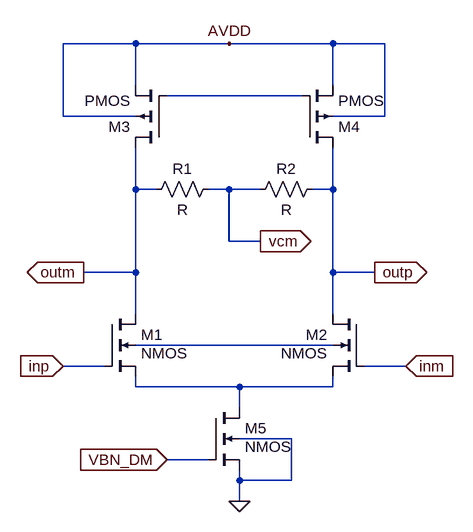
[diagram p0: schematic zc_dm_amp.asc]
zc_dm_amp.asc, the LTspice schematic file:
Version 4
SHEET 1 1464 708
WIRE 336 -176 224 -176
WIRE 480 -176 336 -176
WIRE 640 -176 480 -176
WIRE 720 -176 640 -176
WIRE 336 -112 336 -176
WIRE 640 -112 640 -176
WIRE 592 -96 384 -96
WIRE 224 -64 224 -176
WIRE 336 -64 224 -64
WIRE 720 -64 720 -176
WIRE 720 -64 640 -64
WIRE 336 48 336 -16
WIRE 368 48 336 48
WIRE 480 48 448 48
WIRE 528 48 480 48
WIRE 640 48 640 -16
WIRE 640 48 608 48
WIRE 480 128 480 48
WIRE 528 128 480 128
WIRE 336 176 336 48
WIRE 336 176 256 176
WIRE 640 176 640 48
WIRE 704 176 640 176
WIRE 336 240 336 176
WIRE 640 240 640 176
WIRE 640 288 336 288
WIRE 288 320 224 320
WIRE 752 320 688 320
WIRE 336 352 336 336
WIRE 496 352 336 352
WIRE 640 352 640 336
WIRE 640 352 496 352
WIRE 496 384 496 352
WIRE 576 432 496 432
WIRE 448 464 384 464
WIRE 496 496 496 480
WIRE 576 496 576 432
WIRE 576 496 496 496
WIRE 496 528 496 496
FLAG 496 528 0
FLAG 224 320 inp
IOPIN 224 320 In
FLAG 384 464 VBN_DM
IOPIN 384 464 In
FLAG 704 176 outp
IOPIN 704 176 Out
FLAG 256 176 outm
IOPIN 256 176 Out
FLAG 752 320 inm
IOPIN 752 320 In
FLAG 480 -176 AVDD
FLAG 528 128 vcm
IOPIN 528 128 Out
SYMBOL nmos4 288 240 R0
WINDOW 3 56 60 Left 2
SYMATTR InstName M1
SYMBOL pmos4 384 -16 R180
SYMATTR InstName M3
SYMBOL nmos4 688 240 M0
WINDOW 3 56 60 Left 2
SYMATTR InstName M2
SYMBOL pmos4 592 -16 M180
SYMATTR InstName M4
SYMBOL nmos4 448 384 R0
WINDOW 3 56 60 Left 2
SYMATTR InstName M5
SYMBOL res 464 32 R90
WINDOW 0 0 56 VBottom 2
WINDOW 3 32 56 VTop 2
SYMATTR InstName R1
SYMBOL res 624 32 R90
WINDOW 0 0 56 VBottom 2
WINDOW 3 32 56 VTop 2
SYMATTR InstName R2

The netlist it stands for:
* zc_dm_amp.asc
M1 outm inp N003 N002 NMOS
M3 outm N001 AVDD AVDD PMOS
M2 outp inm N003 N002 NMOS
M4 outp N001 AVDD AVDD PMOS
M5 N003 VBN_DM 0 0 NMOS
R1 vcm outm R
R2 outp vcm R
.model NMOS NMOS
.model PMOS PMOS
.lib standard.mos
.backanno
.end